# EAGLE design Motherboard (EAGLE 9.6.2)
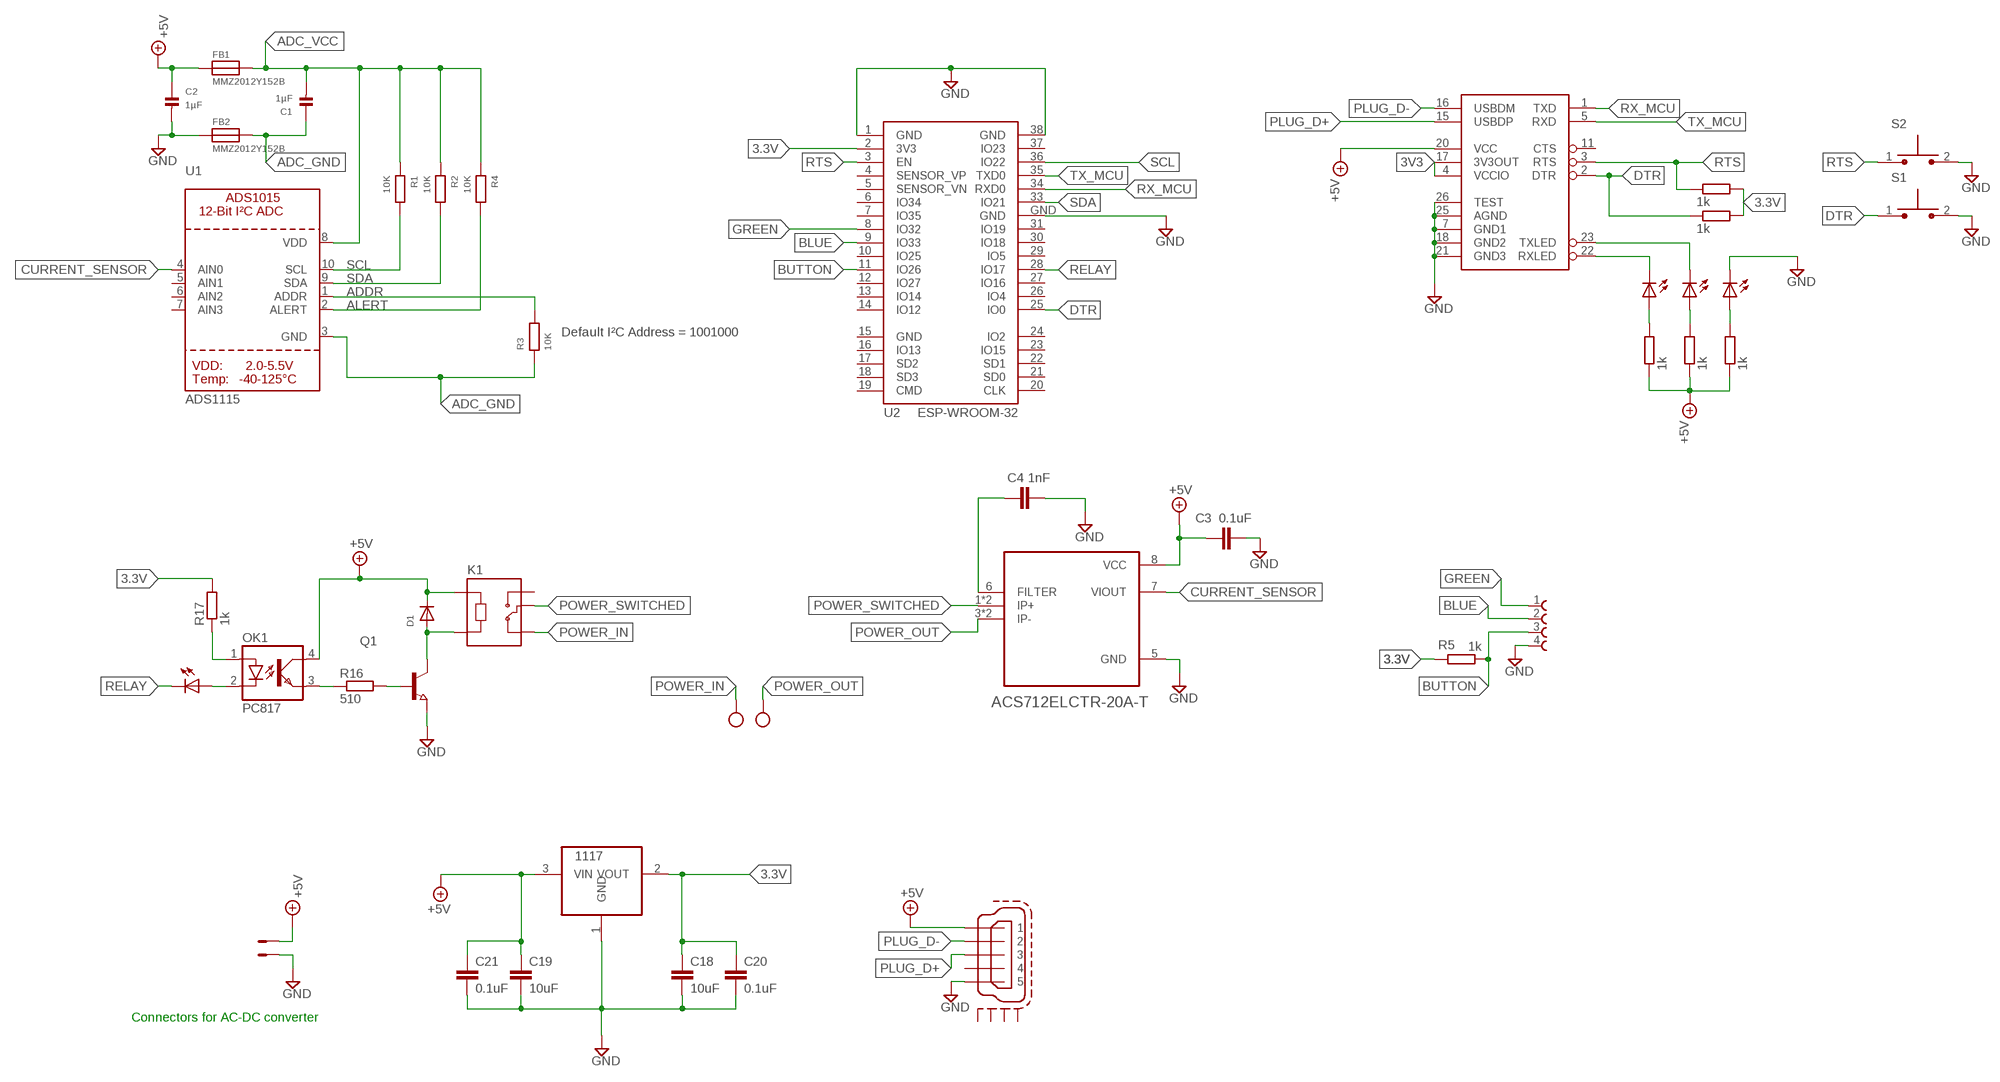
[diagram p0: schematic, sheet 1]

## Parts
C1  1µF  CAP_CERAMIC0805  [0805]
C2  1µF  CAP_CERAMIC0805  [0805]
C3  0.1uF  0.1UF-0603-25V-(+80/-20%)  [0603]
C4  1nF  1.0NF/1000PF-0603-50V-10%  [0603]
C18  10uF  10UF-1206-6.3V-20%  [1206]
C19  10uF  10UF-1206-6.3V-20%  [1206]
C20  0.1uF  0.1UF-0603-25V-(+80/-20%)  [0603]
C21  0.1uF  0.1UF-0603-25V-(+80/-20%)  [0603]
D1  DIODE_SOD-123FL  [SOD-123FL]
FB1  MMZ2012Y152B  FERRITE0805  [0805]
FB2  MMZ2012Y152B  FERRITE0805  [0805]
IC1  1117  REG1117  [SOT223]
K1  SRD-05VDC-SL-C  [RELAY_SRD-05VDC-SL-C]
K2  68610414122  [68610414122]
OK1  PC817  [DIL04]
POWER_LED  LEDCHIP-LED0603  [CHIP-LED0603]
Q1  NPN-TRANSISTOR_SOT23  [SOT23]
R1  10K  R-EU_R0603  [R0603]
R2  10K  R-EU_R0603  [R0603]
R3  10K  R-EU_R0603  [R0603]
R4  10K  R-EU_R0603  [R0603]
R5  1k  R-EU_R0603  [R0603]
R7  1k  R-EU_R0603  [R0603]
R8  1k  R-EU_R0603  [R0603]
R9  1k  R-EU_R0603  [R0603]
R10  1k  R-EU_R0603  [R0603]
R11  1k  R-EU_R0603  [R0603]
R16  510  R-EU_R0603  [R0603]
R17  1k  R-EU_R0603  [R0603]
RELAY  LEDCHIP-LED0603  [CHIP-LED0603]
RX_LED  LEDCHIP-LED0603  [CHIP-LED0603]
S1  TL1015AF160QG  [SW_TL1015AF160QG]
S2  TL1015AF160QG  [SW_TL1015AF160QG]
TX_LED  LEDCHIP-LED0603  [CHIP-LED0603]
U1  ADS1115  ADC_ADS1015  [MSOP10]
U2  ESP-WROOM-32  [ESP-WROOM-32]
U3  FT232RL  FT232RL-BASICSSOP  [SSOP28DB]
U4  ACS712ELCTR-20A-T  [SOIC127P600X175-8N]
U$2  ZX62D-B-5P8  [ZX62D-B-5P8]
X1  W237-102  [W237-102]
X2  22-23-2021  [22-23-2021]

## Nets
3.3V: C18.1 C20.1 IC1.2(VOUT) R5.1 R8.2 R11.2 R17.2 U2.2(3V3)
3V3: U3.4(VCCIO) U3.17(3V3OUT)
+5V: C2.1 C3.1 C19.1 C21.1 D1.C FB1.1 IC1.3(VIN) K1.A1 OK1.4(COL) R7.1 R9.1 R10.1 U3.20(VCC) U4.8(VCC) U$2.P$1 X2.1
ACS_FILTER: C4.1 U4.6(FILTER)
ADC_GND: C1.1 FB2.2 R3.1 U1.3(GND)
ADC_VCC: C1.2 FB1.2 R1.1 R2.1 R4.1 U1.8(VDD)
ADDR: R3.2 U1.1(ADDR)
ALERT: R4.2 U1.2(ALERT)
BLUE: K2.2 U2.9(IO33)
BUTTON: K2.3 R5.2 U2.11(IO26)
CURRENT_SENSOR: U1.4(AIN0) U4.7(VIOUT)
DTR: R11.1 S1.1 U2.25(IO0) U3.2(DTR)
GND: C2.2 C3.2 C4.2 C18.2 C19.2 C20.2 C21.2 FB2.1 IC1.1(GND) K2.4 POWER_LED.C Q1.2(E) S1.2 S2.2 U2.1(GND) U2.38(GND) U2.GND U3.7(GND1) U3.18(GND2) U3.21(GND3) U3.25(AGND) U3.26(TEST) U4.5(GND) U$2.P$5 X2.2
GREEN: K2.1 U2.8(IO32)
N$1: OK1.2(C) RELAY.A
N$2: OK1.1(A) R17.1
N$3: R10.2 TX_LED.A
N$4: OK1.3(EMIT) R16.1
N$7: Q1.1(B) R16.2
N$13: R9.2 RX_LED.A
PLUG_D+: U3.15(USBDP) U$2.P$3
PLUG_D-: U3.16(USBDM) U$2.P$2
POWER_IN: K1.NC X1.1
POWER_LED: POWER_LED.A R7.2
POWER_OUT: U4.3(IP-) U4.4(IP-) X1.2
POWER_SWITCHED: K1.COM U4.1(IP+) U4.2(IP+)
RELAY: RELAY.C U2.28(IO17)
RELAY_GND: D1.A K1.A2 Q1.3(C)
RTS: R8.1 S2.1 U2.3(EN) U3.3(RTS)
RX_LED: RX_LED.C U3.22(RXLED)
RX_MCU: U2.34(RXD0) U3.1(TXD)
SCL: R1.2 U1.10(SCL) U2.36(IO22)
SDA: R2.2 U1.9(SDA) U2.33(IO21)
TX_LED: TX_LED.C U3.23(TXLED)
TX_MCU: U2.35(TXD0) U3.5(RXD)
Unconnected: K1.NO U1.5(AIN1) U1.6(AIN2) U1.7(AIN3) U2.4(SENSOR_VP) U2.5(SENSOR_VN) U2.6(IO34) U2.7(IO35) U2.10(IO25) U2.12(IO27) U2.13(IO14) U2.14(IO12) U2.16(IO13) U2.17(SD2) U2.18(SD3) U2.19(CMD) U2.20(CLK) U2.21(SD0) U2.22(SD1) U2.23(IO15) U2.24(IO2) U2.26(IO4) U2.27(IO16) U2.29(IO5) U2.30(IO18) U2.31(IO19) U2.37(IO23) U3.11(CTS) U$2.P$4 U$2.SH1 U$2.SH2 U$2.SH3 U$2.SH4

## Notes on the sheet
- Default I²C Address = 1001000
- Connectors for AC-DC converter

## Power pins joined to a net without a drawn wire
GND: U2.15(GND)

## Library data of the parts
C1 C2 = microbuilder:CAP_CERAMIC: Ceramic Capacitors 0402 - 0402 Surface Mount Capacitors 16pF 50V 5% [Digikey: 445-4899-2-ND] 18pF 50V 5% [Digikey: 490-1281-2-ND] 22pF 50V 5% [Digikey: 490-1283-2-ND] 68pF 50V 5% [Digikey: 490-1289-2-ND] 0.1uF 10V 10% [Digikey: 490-1318-2-ND] 1.0uF 6.3V 10% [Digikey: 490-1320-2-ND] 0603 - 0603 Surface Mount Capacitors 16 pF 50V 5% [Digikey: 445-5051-2-ND] 22 pF 50V [Digikey: PCC220ACVTR-ND] 33 pF 50V 5% [Digikey: 490-1415-1-ND] 56pF 50V 5% [Digikey: 490-1421-1-ND] 220pF 50V 5% [Digikey: 445-1285-1-ND] 680 pF 50V 2200 pF 50V 5% C0G [Digikey: 445-1297-1-ND] 5600 pF 100V 5% X7R [Digikey: 478-3711-1-ND] 0.1 µF 25V 10% [Digikey: PCC2277TR-ND] 0.22 µF 16V 10% X7R [Digikey: 445-1318-1-ND] 1.0 µF 25V 10% [Digikey: 445-5146-2-ND] 0603 - RF Specific 3pF 250V +/-0.1pF RF [Digikey: 712-1347-1-ND] 18 pF 250V 5% [Digikey: 478-3505-1-ND or 712-1322-1-ND] 56 pF 250V 5% C0G RF [Digikey: 490-4867-1-ND] 68 pF 250V RF [Digikey: 490-4868-1-ND] 0805 - 0805 Surface Mount Capacitors 220 pF 250V 2% RF Ceramic Capacitor [Digikey: 712-1398-1-ND] 1000 pF 50V 2% NP0 Ceramic Capacitor [Digikey: 478-3760-1-ND] 0.1 µF 25V 10% Ceramic Capacitor [Digikey: PCC1828TR-ND] 1.0 µF 16V 10% Ceramic Capacitor[Digikey: 490-1691-2-ND] 10.0 µF 10V 10% Ceramic Capacitor[Digikey: 709-1228-1-ND] 10.0 uF 16V 10% Ceramic Capacitor [Digikey: 478-5165-2-ND] 47 uF 6.3V 20% Ceramic Capacitor [Digikey: 587-1779-1-ND or 399-5506-1-ND] 1206 - 1206 Surface Mount Capacitors 47uF 10V 20% Ceramic Capacitor [Digikey: 490-5528-1-ND or 399-5508-1-ND or 445-6010-1-ND] 100uF 6.3V -20%, +80% Y5V Ceramic Capacitor (Digikey: 490-4512-1-ND, Mouser: 81-GRM31CF50J107ZE1L)
C3 C20 C21 = SparkFun-Capacitors:0.1UF: 0.1µF ceramic capacitors A capacitor is a passive two-terminal electrical component used to store electrical energy temporarily in an electric field.; PROD_ID: CAP-00810
C4 = SparkFun-Capacitors:1.0NF/1000PF: 1nF/1,000pF ceramic capacitors A capacitor is a passive two-terminal electrical component used to store electrical energy temporarily in an electric field.; PROD_ID: CAP-07886
C18 C19 = SparkFun-Capacitors:10UF: 10.0µF ceramic capacitors A capacitor is a passive two-terminal electrical component used to store electrical energy temporarily in an electric field.; PROD_ID: CAP-10057
D1 = adafruit:DIODE: Diode SMADIODE - SMA Surface Mount Package 20V 1A Schottky Diode Digikey: 641-1014-6-ND DO-1N4148 - Through Hole Small Current Diode SOD-123 20V 1 A (.5mV Vf) Schottky Diode - Digikey: MBRX120TPMSCT-ND SOD-323 10V 570mA (.38mV Vf, 3ns) Schottky Diode - Digikey: ZLLS410CT-ND SOD-523 30V 30mA Schottky Diode (RB751S-40TE61) - Digikey: RB751S-40TE61CT-ND SOT23-R/W - SOT23 Package (R = Solder Paste/Reflow Ovens, W = Hand-Soldering) BAT54Film 40V 300mA - Digikey: 497-7162-1-ND
FB1 FB2 = microbuilder:FERRITE: Ferrite Bead 0603 MMZ1608B121C - 120 Ohm, 600mA Ferrite Chip - Digikey: 445-2164-1-ND BK1608HW121-T - 120 Ohm, 600mA Ferrite Chip - Digikey: 587-1876-2-ND 0805 HZ0805B272R-10 - 2.7K Ohm @ 100MHz, 200mA 0.8 Ohm DC Resistance - Digikey: 240-2504-1-ND (see also Murata BLM21BD272SN1L)
IC1 = burr-brown:REG1117: 800mA and 1A Low Dropout (LDO) Positive Regulator 1.8V, 2.5V, 2.85V, 3.3V, 5V, and Adj; MPN: REG1117; OC_FARNELL: 1097566; OC_NEWARK: 14P6981
K1 = SRD-05VDC-SL-C:SRD-05VDC-SL-C: 5V Trigger Relay Module For Arduino And Raspberry Pi 5V Trigger Relay Module For Arduino And Raspberry Pi Check availability <https://pricing.snapeda.com/parts/SRD-05VDC-SL-C/Songle%20Relay/view-part?ref=eda>; AVAILABILITY: Not in stock; DESCRIPTION: 5V Trigger Relay Module For Arduino And Raspberry Pi 5V Trigger Relay Module For Arduino And Raspberry Pi; MF: Songle Relay; MP: SRD-05VDC-SL-C; PACKAGE: None; PRICE: None
K2 = 4_pin_smd_connector:68610414122: WR-FPC 1.00mm SMT ZIF Horizontal Top Contact, 4 Pins=>Code : Con_FPC_ZIF_1.00_68610414122 <http://katalog.we-online.de/media/images/eican/Con_FPC_ZIF_1.00_6861xx14122_pf2.jpg> Details see: http://katalog.we-online.de/en/em/686_1xx_141_22 Created 2014-07-09, Karrer Zheng 2014 (C) Würth Elektronik
OK1 = optocoupler:PC817: SHARP OPTO COUPLER; MPN: PC817X4J000F; OC_FARNELL: 9707727; OC_NEWARK: 97K7059
POWER_LED RELAY RX_LED TX_LED = adafruit_custom:LED: LED OSRAM: - CHIPLED LG R971, LG N971, LY N971, LG Q971, LY Q971, LO R971, LY R971 LH N974, LH R974 LS Q976, LO Q976, LY Q976 LO Q996 - Hyper CHIPLED LW Q18S LB Q993, LB Q99A, LB R99A - SideLED LS A670, LO A670, LY A670, LG A670, LP A670 LB A673, LV A673, LT A673, LW A673 LH A674 LY A675 LS A676, LA A676, LO A676, LY A676, LW A676 LS A679, LY A679, LG A679 - Hyper Micro SIDELED® LS Y876, LA Y876, LO Y876, LY Y876 LT Y87S - SmartLED LW L88C, LW L88S LB L89C, LB L89S, LG L890 LS L89K, LO L89K, LY L89K LS L896, LA L896, LO L896, LY L896 - TOPLED LS T670, LO T670, LY T670, LG T670, LP T670 LSG T670, LSP T670, LSY T670, LOP T670, LYG T670 LG T671, LOG T671, LSG T671 LB T673, LV T673, LT T673, LW T673 LH T674 LS T676, LA T676, LO T676, LY T676, LB T676, LH T676, LSB T676, LW T676 LB T67C, LV T67C, LT T67C, LS T67K, LO T67K, LY T67K, LW E67C LS E67B, LA E67B, LO E67B, LY E67B, LB E67C, LV E67C, LT E67C LW T67C LS T679, LY T679, LG T679 LS T770, LO T770, LY T770, LG T770, LP T770 LB T773, LV T773, LT T773, LW T773 LH T774 LS E675, LA E675, LY E675, LS T675 LS T776, LA T776, LO T776, LY T776, LB T776 LHGB T686 LT T68C, LB T68C - Hyper Mini TOPLED® LB M676 - Mini TOPLED Santana® LG M470 LS M47K, LO M47K, LY M47K Source: http://www.osram.convergy.de/
Q1 = semicon-smd-ipc:NPN-TRANSISTOR_: NPN TRANSISTOR
R1-R5 R7-R11 R16 R17 = rcl:R-EU_: RESISTOR, European symbol; SPICEPREFIX: R
S1 S2 = small_tactile_switch:TL1015AF160QG: Tactile Switch SPST-NO Top Actuated Surface Mount Check availability <https://pricing.snapeda.com/parts/TL1015AF160QG/E-Switch/view-part?ref=eda>; AVAILABILITY: In Stock; DESCRIPTION: Tactile Switch SPST-NO Top Actuated Surface Mount; MF: E-Switch; MP: TL1015AF160QG; PACKAGE: None; PRICE: None; PURCHASE-URL: https://pricing.snapeda.com/search/part/TL1015AF160QG/?ref=eda
U1 = microbuilder:ADC_ADS1015: ADS1015 - 12-bit 4-Channel I2C ADC with Internal PGA VDD: 2.0-5.5V Sampling Rate: 3.3ksps Gain Settings: 2/3, 1, 2, 4, 8, 16 I2C Address: ADDR low = 1001000x, ADDR high = 1001001x Internal Comparator The ADS1015 includes an internal comparator that can be set to output a high-level on ALERT when the conversion results exceeeds a pre-defined upper level, and will deassert itself when the level falls below a pre-defined lower threshold level. It can also be set to windowed mode where the ALERT pin will be asserted if the data exceeds the upper threshold or falls below the lower threshold.
U2 = esp32:ESP-WROOM-32: Espressif Systems ESP-WROOM-32
U3 = SparkFun-IC-Comms:FT232RL-BASIC: FT232RL USB UART This is the simplified version of the FT232RL unit. Only what you need, nothing you don't. FT232RL 4th Generation USB UART (USB <-> Serial) Controller. Datasheet <http://www.sparkfun.com/datasheets/IC/FT232R_v104.pdf> SparkFun Products Component <https://www.sparkfun.com/products/650> (COM-00650) SparkFun RedBot Mainboard <https://www.sparkfun.com/products/12097> (ROB-12097) SparkFun FTDI Basic Breakout - 5V <https://www.sparkfun.com/products/9716> (DEV-09716) SparkFun FTDI Basic Breakout - 3.3V <https://www.sparkfun.com/products/9873> (DEV-09873) Bus Pirate - v3.6a <https://www.sparkfun.com/products/12942> (TOL-12942) SparkFun USB to Serial Breakout - FT232RL <https://www.sparkfun.com/products/12731> (BOB-12731) SparkFun PicoBoard <https://www.sparkfun.com/products/11888> (WIG-11888) SparkFun RFID USB Reader <https://www.sparkfun.com/products/9963> (SEN-09963) LilyPad FTDI Basic Breakout - 5V <https://www.sparkfun.com/products/10275> (DEV-10275) SparkFun Stepoko <https://www.sparkfun.com/products/13899> (ROB-13899); PROD_ID: IC-00870
U4 = ACS712ELCTR-20A-T:ACS712ELCTR-20A-T: Check availability <https://pricing.snapeda.com/parts/ACS712ELCTR-20A-T/Allegro/view-part?ref=eda>; AVAILABILITY: In Stock; DESCRIPTION: Current Sensor 20A 1 Channel Hall Effect, Open Loop Bidirectional 8-SOIC (0.154, 3.90mm Width); MF: Allegro; MP: ACS712ELCTR-20A-T; PACKAGE: SOIC-8 Allegro MicroSystems LLC; PRICE: None; PURCHASE-URL: https://pricing.snapeda.com/search/part/ACS712ELCTR-20A-T/?ref=eda
U$2 = j_usb_hirose_zx62d-b-5p8:ZX62D-B-5P8: Hirose ZX62D-B-5P8 Micro-B USB connector, standard mount location, with through-hold shell tabs and SMD pins.
X1 = con-wago-500:W237-102: WAGO SCREW CLAMP; MPN: 237-102; OC_FARNELL: unknown; OC_NEWARK: 70K9898
X2 = con-molex:22-23-2021: .100" (2.54mm) Center Header - 2 Pin; MF: MOLEX; MPN: 22-23-2021; OC_FARNELL: 1462926; OC_NEWARK: 25C3832

## Net classes
0 default: width 0.254 mm, drill 0.305 mm, clearance 0.152 mm
1 gnd: width 0.635 mm, drill 0.635 mm, clearance 0.254 mm
2 vcc: width 0.406 mm, drill 0.406 mm, clearance 0.254 mm

## Board
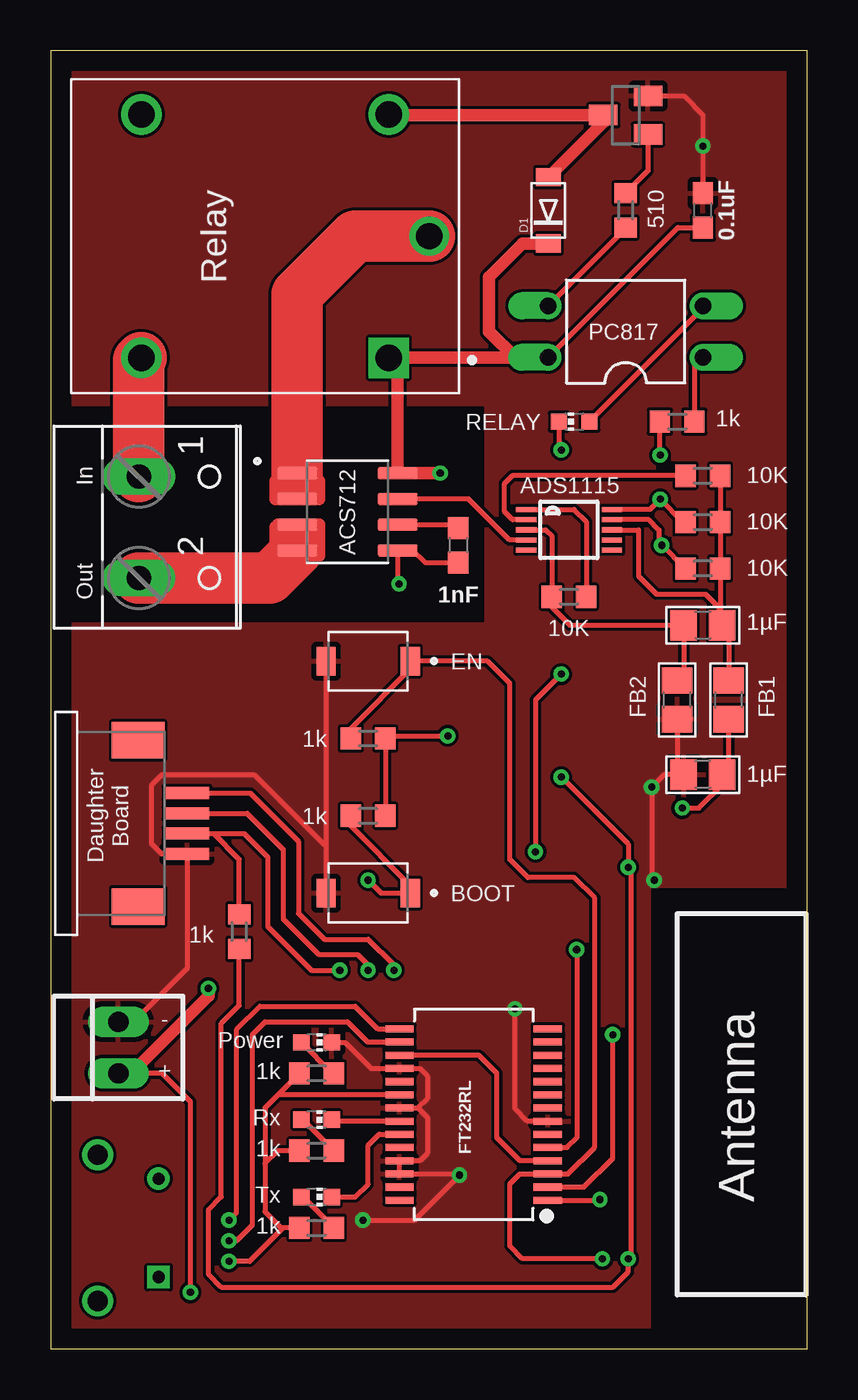
[diagram p1: board, top side]
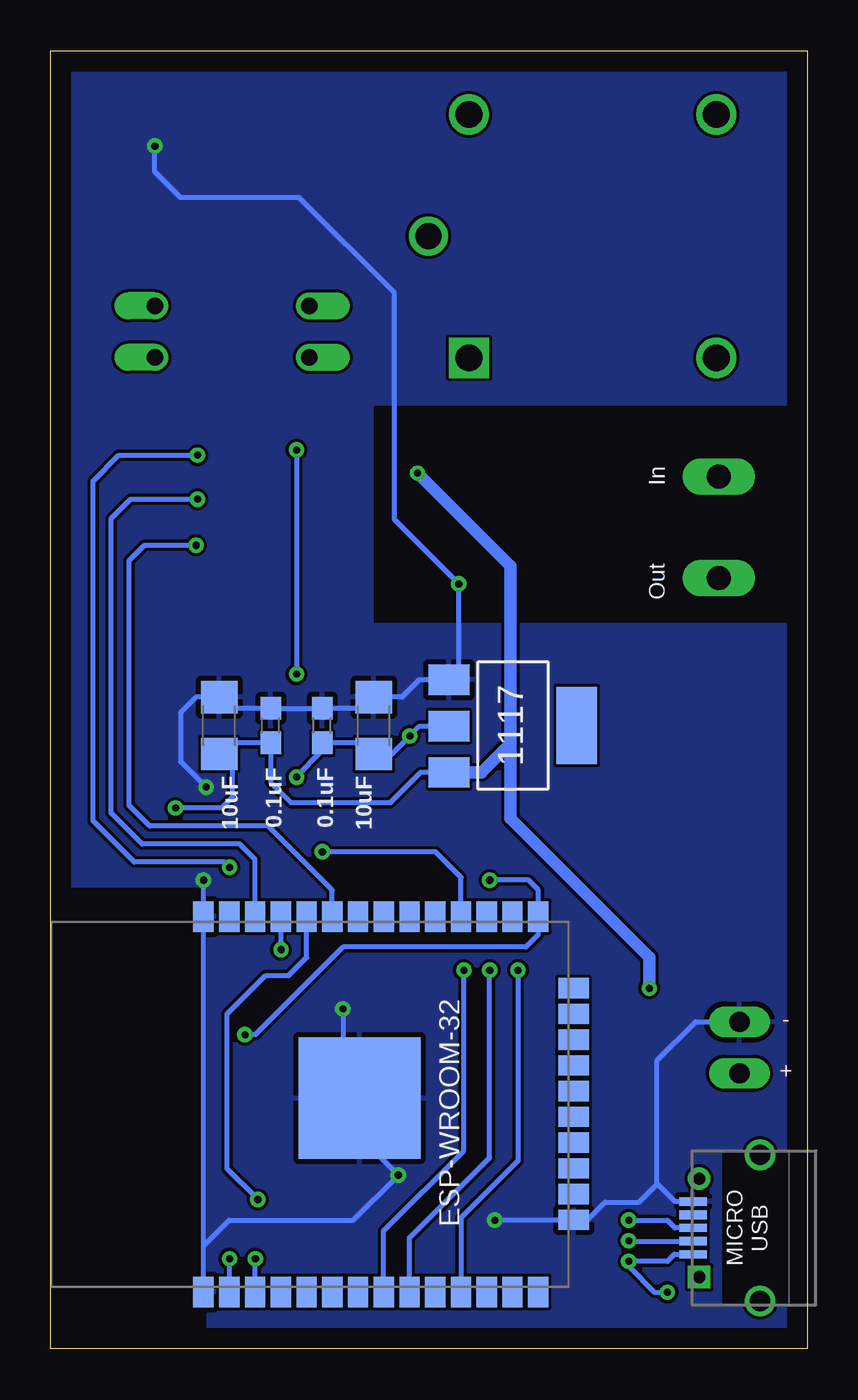
[diagram p2: board, bottom side, seen from below]

Size 37.3 x 64 mm. Coordinates in mm from the lower left corner, seen from the top.
Outline: 37.3,64 0,64 0,0 37.3,0 37.3,64
Copper layers (1*16): Top 0.035mm / dielectric 1.5mm / Bottom 0.035mm
Design rules "default": minimum track width 6mil, minimum drill 0.35mm, track to track 6mil, track to pad 6mil, pad to pad 6mil, via to via 6mil, smd to smd 6mil, copper to edge 40mil, drill to drill 6mil, minimum pad ring 10mil, minimum via ring 8mil, stop-mask expansion 4mil, vias tented up to drill 0mil, thermal gap 10mil

### Footprints (pad centres in the part's own frame; a part is rotated, then mirrored left to right if it is on the bottom)
0805 = smd 1.3 x 1.5: 1 -0.95,0; 2 0.95,0
0603 = smd 1.1 x 1: 1 -0.85,0; 2 0.85,0
1206 = smd 1.6 x 1.8: 1 -1.4,0; 2 1.4,0
SOD-123FL = smd 0.91 x 1.22: A 1.637,0; C -1.637,0
SOT223 = smd 1.499 x 2.007: 1 -2.261,-3.15; 2 0.025,-3.15; 3 2.311,-3.15 | smd 3.81 x 2.007: 4 0,3.15
RELAY_SRD-05VDC-SL-C = drill 1.32 square: A1 -6.1,6 | drill 1.32: A2 -6.1,-6; NC 6.1,6; NO 6.1,-6 | drill 1.29: COM -8.1,0
68610414122 = smd 0.6 x 2.2: 1 -1.5,1.1; 2 -0.5,1.1; 3 0.5,1.1; 4 1.5,1.1 | smd 1.8 x 2.6: Z1 -4.1,-1.3; Z2 4.1,-1.3
DIL04 = drill 0.813 offset: 1 -1.27,-3.81; 2 1.27,-3.81; 3 1.27,3.81; 4 -1.27,3.81
CHIP-LED0603 = smd 0.8 x 0.8: A 0,-0.75; C 0,0.75
SOT23 = smd 1 x 1.4: 1 -0.95,-1.1; 2 0.95,-1.1; 3 0,1.1
R0603 = smd 1 x 1.1: 1 -0.85,0; 2 0.85,0
SW_TL1015AF160QG = smd 0.95 x 1.4: 1 -2.075,0; 2 2.075,0
MSOP10 = smd 0.25 x 1: 1 -1,-2.113; 2 -0.5,-2.113; 3 0,-2.113; 4 0.5,-2.113; 5 1,-2.113; 6 1,2.113; 7 0.5,2.113; 8 0,2.113; 9 -0.5,2.113; 10 -1,2.113
ESP-WROOM-32 = smd 1.5 x 1: 1 -9.25,7; 2 -9.25,5.73; 3 -9.25,4.46; 4 -9.25,3.19; 5 -9.25,1.92; 6 -9.25,0.65; 7 -9.25,-0.62; 8 -9.25,-1.89; 9 -9.25,-3.16; 10 -9.25,-4.43; 11 -9.25,-5.7; 12 -9.25,-6.97; 13 -9.25,-8.24; 14 -9.25,-9.51; 25 9.25,-9.51; 26 9.25,-8.24; 27 9.25,-6.97; 28 9.25,-5.7; 29 9.25,-4.43; 30 9.25,-3.16; 31 9.25,-1.89; 32 9.25,-0.62; 33 9.25,0.65; 34 9.25,1.92; 35 9.25,3.19; 36 9.25,4.46; 37 9.25,5.73; 38 9.25,7 | smd 1 x 1.5: 15 -5.7,-11.25; 16 -4.43,-11.25; 17 -3.16,-11.25; 18 -1.89,-11.25; 19 -0.62,-11.25; 20 0.65,-11.25; 21 1.92,-11.25; 22 3.19,-11.25; 23 4.46,-11.25; 24 5.73,-11.25 | smd 6 x 6: GND 0.3,-0.7
SSOP28DB = smd 0.348 x 1.397: 1 -4.225,-3.656; 2 -3.575,-3.656; 3 -2.925,-3.656; 4 -2.275,-3.656; 5 -1.625,-3.656; 6 -0.975,-3.656; 7 -0.325,-3.656; 8 0.325,-3.656; 9 0.975,-3.656; 10 1.625,-3.656; 11 2.275,-3.656; 12 2.925,-3.656; 13 3.575,-3.656; 14 4.225,-3.656; 15 4.225,3.656; 16 3.575,3.656; 17 2.925,3.656; 18 2.275,3.656; 19 1.625,3.656; 20 0.975,3.656; 21 0.325,3.656; 22 -0.325,3.656; 23 -0.975,3.656; 24 -1.625,3.656; 25 -2.275,3.656; 26 -2.925,3.656; 27 -3.575,3.656; 28 -4.225,3.656
SOIC127P600X175-8N = smd 1.97 x 0.6: 1 -2.475,1.905; 2 -2.475,0.635; 3 -2.475,-0.635; 4 -2.475,-1.905; 5 2.475,-1.905; 6 2.475,-0.635; 7 2.475,0.635; 8 2.475,1.905
ZX62D-B-5P8 = smd 0.4 x 1.35: P$1 -1.3,3.31; P$2 -0.65,3.31; P$3 0,3.31; P$4 0.65,3.31; P$5 1.3,3.31 | drill 0.6 pad 1 square: SH1 -2.425,3 | drill 0.6 pad 1: SH2 2.425,3 | drill 1 pad 1.4: SH3 -3.6,0; SH4 3.6,0
W237-102 = drill 1.194 long: 1 -2.5,-1.27; 2 2.5,-1.27
22-23-2021 = drill 1 long: 1 -1.27,0; 2 1.27,0

### Placement (x,y rotation side)
C1  32.16,35.68 0 top
C2  32.16,28.31 180 top
C3  32.16,56.13 90 top
C4  20.1,39.62 270 top
C18  21.37,30.73 90 bottom
C19  28.99,30.73 90 bottom
C20  23.91,30.73 90 bottom
C21  26.45,30.73 90 bottom
D1  24.54,56.13 90 top
FB1  33.43,32 90 top
FB2  30.89,32 90 top
IC1  14.51,30.73 270 bottom
K1  10.57,54.86 180 top
K2  5.62,25.9 270 top
OK1  28.35,50.16 90 top
POWER_LED  13.11,15.11 270 top
Q1  28.35,60.83 90 top
R1  32.16,40.76 180 top
R2  32.16,38.47 180 top
R3  25.56,37.08 0 top
R4  32.16,43.05 180 top
R5  9.3,20.57 90 top
R7  13.11,13.58 0 top
R8  15.65,30.09 0 top
R9  13.11,9.77 0 top
R10  13.11,5.96 0 top
R11  15.65,26.28 0 top
R16  28.35,56.13 90 top
R17  30.89,45.71 180 top
RELAY  25.81,45.71 90 top
RX_LED  13.11,11.3 270 top
S1  15.65,22.47 180 top
S2  15.65,33.9 180 top
TX_LED  13.11,7.49 270 top
U1  25.56,40.38 270 top
U2  22.76,12.06 90 bottom
U3  20.86,11.55 90 top
U4  14.64,41.27 0 top
U$2  2.32,5.96 90 bottom
X1  5.62,40.51 270 top
X2  3.33,14.85 90 top

### Tracks (layer width: path | path; a pad name or v marks a point on that pad's centre or on a via)
3.3V  (via drill 0.35)
  Top 0.254: R5.1 9.3,16.92 8.41,16.03 8.41,7.49 7.78,6.85 7.78,3.68 8.41,3.04 27.72,3.04 28.48,3.8 v28.48,4.44 28.61,4.56 28.61,23.61 v28.48,23.74 28.48,24.88 v25.18,28.19 | v30.06,44.06 30.04,44.1 R17.2 | R11.2 R8.2 16.63,30.22 v19.59,30.22
  Bottom 0.254: U2.2 28.48,2.82 v28.48,4.44 | IC1.2 19.1,30.7 v19.59,30.22 20.48,29.33 C18.1 21.92,29.88 C20.1 23.91,29.5 25.18,28.23 v25.18,28.19 | v28.48,23.74 28.73,24 33.18,24 35.21,26.03 35.21,42.79 33.94,44.06 v30.06,44.06
3V3
  Top 0.254: U3.4 23.13,9.27 22,10.41 22,13.58 21.11,14.47 U3.17
+5V  (via drill 0.35)
  Top 0.254: 10.57,11.89 10.57,9.14 | 10.57,11.89 11.21,12.52 U3.20 | R9.1 11.21,9.77 10.57,9.14 | 10.57,9.14 10.57,6.76 11.37,5.96 R10.1 11.46,5.96 9.81,4.31 v8.79,4.31 | 10.57,11.89 R7.1 | 24.51,48.86 30.93,55.28 C3.1 | FB1.1 33.43,28.63 C2.1 | X2.1 5.49,13.58 6.89,12.18 v6.89,2.79 | X2.1 4.1,13.58 | 33.11,28.63 C2.1 | v31.15,26.66 31.97,26.66 33.11,27.81 C2.1 | X2.1 4.22,13.58
  Top 0.61: 22.92,48.86 K1.A1 17.11,48.42 U4.8 v19.21,43.17 | OK1.4 24.51,48.86 22.92,48.86 | D1.C 23.27,54.49 21.62,52.84 21.62,50.16 22.92,48.86 | v7.78,17.77 7.78,17.39 3.97,13.58 X2.1
  Bottom 0.254: U$2.P$1 6.54,4.66 6.89,4.31 v8.79,4.31 8.79,4.06 7.52,2.79 v6.89,2.79 | IC1.3 18.19,28.42 19.06,28.42 20.55,26.92 25.43,26.92 26.45,27.93 C21.1 28.44,29.88 C19.1 28.35,28.69 28.35,27.17 28.86,26.66 v31.15,26.66
  Bottom 0.61: v19.21,43.17 14.64,38.6 14.64,29.84 | 14.64,29.84 16.06,28.42 18.19,28.42 | 14.64,29.84 14.64,26.15 7.78,19.3 v7.78,17.77
ACS_FILTER
  Top 0.254: U4.6 19.93,40.63 C4.1
ADC_GND
  Top 0.254: U1.3 24.42,40.38 24.71,40.09 R3.1 24.71,36.57 25.6,35.68 C1.1 31.21,33.27 FB2.2
ADC_VCC
  Top 0.254: R4.1 R1.1 R2.1 33.01,36.48 | 33.01,36.48 33.01,35.78 C1.2 33.43,35.36 FB1.2 | 33.01,36.48 32.29,37.2 29.88,37.2 28.99,38.09 28.99,40.38 U1.8
ADDR
  Top 0.254: U1.1 25.81,41.38 26.41,40.78 R3.2
ALERT
  Top 0.254: R4.2 22.76,43.05 22.38,42.66 22.38,41.27 22.77,40.88 U1.2
BLUE  (via drill 0.35)
  Top 0.254: v15.65,18.66 15.65,18.92 15.14,19.42 13.24,19.42 11.46,21.2 11.46,24.63 9.69,26.4 K2.2
  Bottom 0.254: U2.9 19.62,2.82 19.62,5.45 15.65,9.42 v15.65,18.66
BUTTON  (via drill 0.35)
  Top 0.254: K2.3 8.03,25.4 | 8.03,25.4 9.55,25.4 10.7,24.25 10.7,20.82 12.86,18.66 v14.26,18.66 | 8.03,25.4 9.3,24.13 R5.2
  Bottom 0.254: v14.26,18.66 14.26,9.26 17.06,6.45 U2.11
CURRENT_SENSOR
  Top 0.254: U1.4 22.63,39.88 20.61,41.9 U4.7
DTR  (via drill 0.35)
  Top 0.254: U3.2 26.3,7.97 27.72,9.39 v27.72,15.49 | R11.1 14.8,25.78 17.73,22.85 S1.1 16.29,22.47 v15.65,23.11
  Bottom 0.254: v15.65,23.11 13.75,23.11 13.25,22.61 U2.25 13.25,20.42 13.87,19.8 22.89,19.8 27.21,15.49 v27.72,15.49
GND  (via drill 0.35)
  Top 0.254: POWER_LED.C 14.51,15.11 15.79,13.82 U3.18 18.2,13.82 18.57,13.45 18.57,12.33 18.12,11.87 | U3.21 18.12,11.87 | 18.12,11.87 18.57,11.42 18.57,9.64 18.2,9.27 U3.25 U3.26 20.1,8.62 v20.16,8.56 17.94,6.34 v15.4,6.34 | Q1.2 31.21,61.78 32.16,60.83 v32.16,59.3 C3.2 | v22.89,16.76 22.89,11.85 23.52,11.22 U3.7 | C4.2 18.45,38.77 17.85,39.36 U4.5 17.11,37.78 v17.18,37.71 | FB2.1 30.89,28.63 C2.2 30.26,28.31 v29.64,27.69 29.64,23.23 v29.76,23.11 | X2.2 4.1,16.12 6.72,18.75 K2.4 5.47,24.4 4.98,24.88 4.98,27.81 5.49,28.31 10.02,28.31 13.58,24.76 | S2.2 13.58,24.76 | 13.58,24.76 S1.2
  Bottom 0.254: 22.06,11.68 U2.GND 22,12.42 22,12.95 22.89,13.84 v22.89,16.76 | U2.1 29.76,5.09 | 29.76,5.09 v29.76,23.11 U2.38 | 22.57,11.17 22.06,11.68 | 22.06,11.68 21.94,11.8 21.94,10.34 v20.16,8.56 22.38,6.34 28.51,6.34 29.76,5.09 | v15.4,6.34 15.38,6.36 U2.15 10.83,6.36 10.83,6.37 9.97,7.23 8.29,7.23 7.4,8.12 7.4,8.15 | 7.4,8.15 6.51,7.26 U$2.P$5 | X2.2 5.49,16.12 7.4,14.22 7.4,8.15 | v32.16,59.3 32.16,58.03 30.89,56.76 25.05,56.76 20.35,52.06 20.35,40.89 v17.18,37.71 17.18,33.47 IC1.1 19.11,32.99 19.97,32.13 C18.2 21.92,31.58 C20.2 C21.2 28.44,31.58 C19.2 30.13,32.13 30.89,31.36 30.89,28.95 v29.64,27.69
  pour Top: -2.13,66.92 -2.13,46.6 21.49,46.6 21.49,35.68 -2.13,35.68 -2.13,-2.93 29.5,-2.93 29.5,22.85 39.78,22.85 39.78,66.92
  pour Bottom: -4.67,69.46 -4.67,46.6 21.49,46.6 21.49,35.68 -4.67,35.68 -4.67,-5.47 29.5,-5.47 29.5,22.85 42.32,22.85 42.32,69.46
GREEN  (via drill 0.35)
  Top 0.254: K2.1 9.83,27.4 12.22,25.01 12.22,21.46 13.49,20.19 15.65,20.19 16.92,18.92 v16.92,18.66
  Bottom 0.254: U2.8 20.87,5.82 16.92,9.77 v16.92,18.66
N$1
  Top 0.254: OK1.2 32.16,51.31 RELAY.A
N$2
  Top 0.254: OK1.1 32.12,48.89 31.74,48.51 R17.1
N$3
  Top 0.254: R10.2 12.44,7.49 TX_LED.A
N$4
  Top 0.254: OK1.3 28.35,55.24 R16.1
N$7
  Top 0.254: R16.2 29.45,58.08 Q1.1
N$13
  Top 0.254: R9.2 12.44,11.3 RX_LED.A
PLUG_D+  (via drill 0.35)
  Top 0.254: U3.15 16.13,15.77 15.02,16.88 10.32,16.88 9.15,15.72 9.15,6.7 v8.79,6.34
  Bottom 0.254: v8.79,6.34 6.9,6.34 6.52,5.96 U$2.P$3
PLUG_D-  (via drill 0.35)
  Top 0.254: U3.16 15.63,15.12 14.64,16.12 10.57,16.12 9.94,15.49 9.94,6.09 9.18,5.33 v8.79,5.33
  Bottom 0.254: v8.79,5.33 8.78,5.31 U$2.P$2
POWER_IN
  Top 2.54: X1.1 4.35,48.73 K1.NC
POWER_LED
  Top 0.254: R7.2 13.89,13.58 POWER_LED.A
POWER_OUT
  Top 0.61: U4.4 12.16,38.79 12.48,38.47 12.6,38.47 13.24,39.11 13.24,40.63 U4.3 11.21,40.63 11.08,40.51 11.08,39.24
  Top 2.54: X1.2 10.8,38.01 U4.4
POWER_SWITCHED
  Top 0.61: U4.1 12.86,43.17 13.24,42.79 13.24,41.9 U4.2 | U4.2 12.73,41.9 | U4.2 11.08,41.9 11.08,42.79 11.27,42.79 U4.2
  Top 2.54: K1.COM 15.02,54.86 12.16,52 U4.1
RELAY  (via drill 0.35)
  Top 0.254: RELAY.C 25.06,44.43 v25.18,44.32 | v25.18,33.27 23.91,32 v23.91,24.5
  Bottom 0.254: v25.18,44.32 v25.18,33.27 | U2.28 17.06,23.25 18.32,24.5 v23.91,24.5
RELAY_GND
  Top 0.61: K1.A2 16.7,60.83 Q1.3 27.25,60.47 D1.A
RTS  (via drill 0.35)
  Top 0.254: v27.21,4.44 23.27,4.44 22.64,5.07 22.64,8.13 23.14,8.62 U3.3 25.51,8.62 26.83,9.94 26.83,22.22 25.81,23.23 23.53,23.23 22.64,24.12 22.64,32.8 21.54,33.9 S2.1 17.73,33.52 14.8,30.6 R8.1
  Bottom 0.254: U2.3 27.21,2.82 v27.21,4.44
RX_LED
  Top 0.254: U3.22 13.93,11.22 RX_LED.C
RX_MCU  (via drill 0.35)
  Top 0.254: U3.1 27.05,7.32 v27.08,7.36
  Bottom 0.254: U2.34 24.67,21.29 24.67,19.3 25.56,18.41 26.7,18.41 28.61,16.5 28.61,8.88 v27.08,7.36
SCL  (via drill 0.35)
  Top 0.254: R1.2 31.19,40.76 v30.06,41.89 29.55,41.38 U1.10
  Bottom 0.254: U2.36 27.22,24.14 27.97,24.88 32.8,24.88 34.32,26.41 34.32,40.93 33.36,41.89 v30.06,41.89
SDA  (via drill 0.35)
  Top 0.254: R2.2 31.27,38.47 v30.13,39.62 30,39.74 30,40.38 29.5,40.88 U1.9
  Bottom 0.254: U2.33 23.41,22.61 26.57,25.77 32.42,25.77 33.43,26.79 33.43,38.85 32.67,39.62 v30.13,39.62
TX_LED
  Top 0.254: TX_LED.C 15.02,7.49 15.65,8.12 15.65,10.03 16.2,10.57 U3.23
TX_MCU  (via drill 0.35)
  Top 0.254: U3.5 25.46,9.92 25.94,10.41 v25.94,19.68
  Bottom 0.254: U2.35 25.95,19.69 v25.94,19.68

### Text on the board
tPlace: Relay | In | ACS712 | Out | EN | Daughter / Board | BOOT | - | Power | + | Rx | Tx | Antenna
bPlace: In | Out | - | + | MICRO / USB